# Altium schematic sheet RTC_SDCARD.SchDoc
size A; SheetNumber: 5; SheetTotal: 9
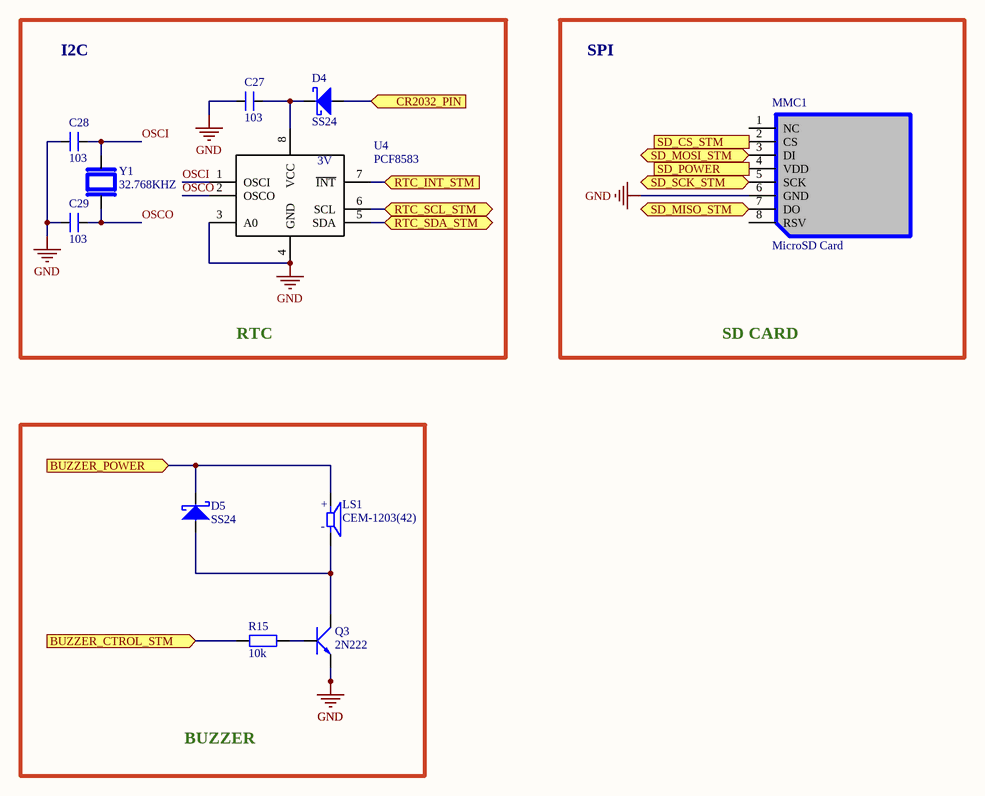
[diagram p0: RTC_SDCARD.SchDoc]

## Parts
C27  103  [SM-0805]
C28  103  [SM-0805]
C29  103  [SM-0805]
D4  SS24  [DIO-SMD-106]
D5  SS24  [DIO-SMD-106]
LS1  CEM-1203(42)  [CUI_CEM-1203(42)]
MMC1  MicroSD Card  [MicroSD-2]
Q3  2N222  [SOT23-231]
R15  10k  [RES-1/4W]
U4  PCF8583  [SO8L]
Y1  32.768KHZ  [XTAL_AB26T-32.768KHZ-E]

## Blocks framed on the sheet
BUZZER: D5 LS1 Q3 R15

## Ports
BUZZER_CTROL_STM (in), BUZZER_POWER (in), CR2032_PIN (in), RTC_INT_STM (in), RTC_SCL_STM (bidir), RTC_SDA_STM (bidir), SD_CS_STM (in), SD_MISO_STM (bidir), SD_MOSI_STM (bidir), SD_POWER (in), SD_SCK_STM (bidir)

## Nets
GND: C27.2 C28.2 C29.1 MMC1.6(GND) Q3.1(E) U4.3(A0) U4.4(GND)
BUZZER_CTROL_STM: R15.2 ; port BUZZER_CTROL_STM
BUZZER_POWER: D5.2 LS1.P ; port BUZZER_POWER
CR2032_PIN: D4.1 ; port CR2032_PIN
OSCI: C28.1 U4.1(OSCI) Y1.1
OSCO: C29.2 U4.2(OSCO) Y1.2
RTC_INT_STM: U4.7(~{INT}) ; port RTC_INT_STM
RTC_SCL_STM: U4.6(SCL) ; port RTC_SCL_STM
RTC_SDA_STM: U4.5(SDA) ; port RTC_SDA_STM
SD_CS_STM: MMC1.2(CS) ; port SD_CS_STM
SD_MISO_STM: MMC1.7(DO) ; port SD_MISO_STM
SD_MOSI_STM: MMC1.3(DI) ; port SD_MOSI_STM
SD_POWER: MMC1.4(VDD) ; port SD_POWER
SD_SCK_STM: MMC1.5(SCK) ; port SD_SCK_STM
NetC27_1: C27.1 D4.2 U4.8(VCC)
NetD5_1: D5.1 LS1.N Q3.3(C)
NetQ3_2: Q3.2(B) R15.1

Not connected (* = marked no-connect by the designer): MMC1 1(NC) 8(RSV)

## Notes on the sheet
- I2C
- SPI
- (near U4) 3V
- RTC
- SD CARD
- (in symbol CEM-1203(42)) +; -

## Library data of the parts
C27-C29 = CM: Cap SMD; Value: 103
D4 D5 = Diode Schottky: Part Number: LED 3 ly Single Colour; Pricing: *
LS1 = CEM-1203(42): 12 mm, 3.5 V, 85 dB, Through Hole, Magnetic Audio Transducer Buzzer; MF: CUI Devices; Package: None; Price: None; Check_prices: https://www.snapeda.com/parts/CEM-1203(42)/CUI+Devices/view-part/?ref=eda; Value: *; CUI_purchase_URL: https://www.cuidevices.com/product/audio/buzzers/audio-transducers/cem-1203(42)?utm_source=snapeda.com&utm_medium=referral&utm_campaign=snapedaBOM; SnapEDA_Link: https://www.snapeda.com/parts/CEM-1203(42)/CUI+Devices/view-part/?ref=snap; MP: CEM-1203(42); Availability: In Stock; Purchase-URL: https://pricing.snapeda.com/search/part/CEM-1203(42)/?ref=eda
Q3 = 2N222: NPN 600mW, ECB; Value: C1815
R15 = R: Resistor R1/4W
U4 = PCF8583: I2C REAL TIME CLOCK; Manufacturer Part Number: PCF8583T/5,518; Manufacturer: NXP Semiconductors; Time Format: HH:MM:SS (12/24 hr); Memory Size: 240B; Voltage - Supply: 1 V ~ 6 V; Date Format: YY-MM-DD; Interface: I²C, 2-Wire Serial; Supplier 1: Digi-Key; Supplier Part Number 1: 568-1085-2-ND; Supplier: Digi-Key; Supplier Part Number: 568-1085-2-ND; Operating Temperature: -40°C ~ 85°C; Packaging: Tape & Reel (TR); Type: Clock/Calendar/NVSRAM; Package / Case: 8-SOIC (7.5mm Width); Category: Integrated Circuits (ICs); RoHS: RoHS Compliant
Y1 = AB26T-32.768KHZ-E: 32.768kHz WATCH CRYSTAL, 6.2 x 02.1MM CYLINDER PACKAGE; MF: Abracon LLC; Package: Radial Abracon LLC; Price: None; MP: AB26T-32.768KHZ-E; Purchase-URL: https://pricing.snapeda.com/search/part/AB26T-32.768KHZ-E/?ref=eda; Availability: In Stock; Value: *; Check_prices: https://www.snapeda.com/parts/AB26T-32.768KHZ-E/Abracon+LLC/view-part/?ref=eda; SnapEDA_Link: https://www.snapeda.com/parts/AB26T-32.768KHZ-E/Abracon+LLC/view-part/?ref=snap